# EAGLE design rc6551z80_v2 (EAGLE 9.6.2)
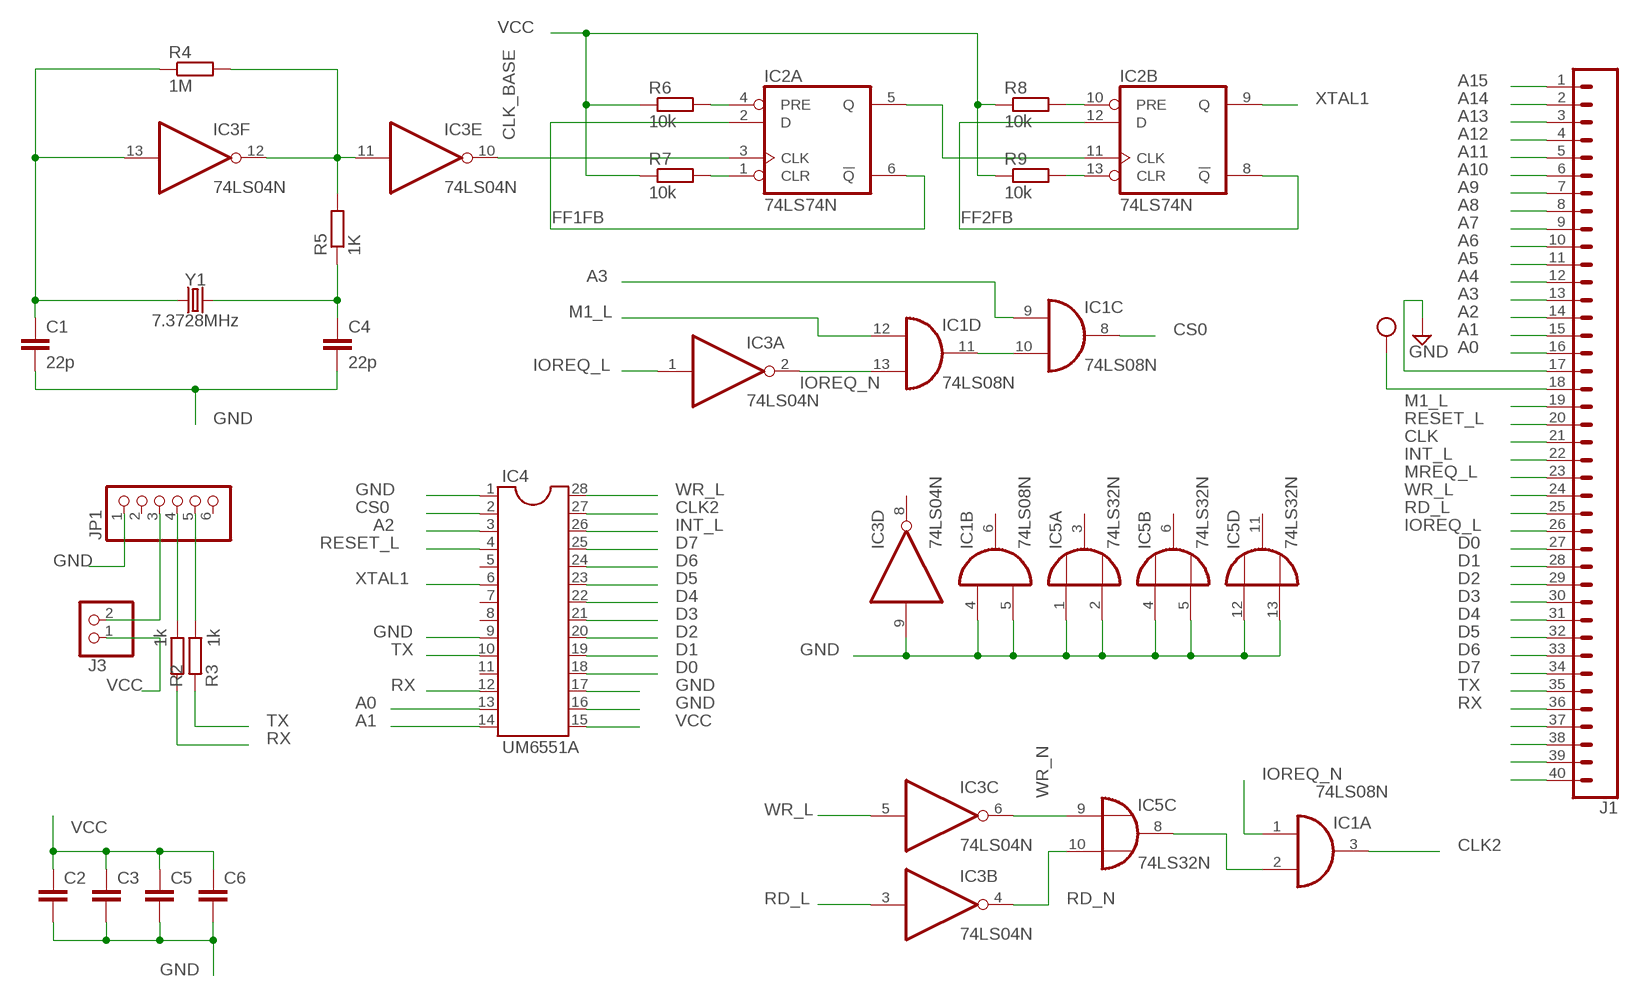
[diagram p0: schematic, sheet 1]

## Parts
C1  22p  C-EU025-024X044  [C025-024X044]
C2  C-EU050-025X075  [C050-025X075]
C3  C-EU050-025X075  [C050-025X075]
C4  22p  C-EU025-024X044  [C025-024X044]
C5  C-EU050-025X075  [C050-025X075]
C6  C-EU050-025X075  [C050-025X075]
IC1  74LS08N  [DIL14]
IC2  74LS74N  [DIL14]
IC3  74LS04N  [DIL14]
IC4  UM6551A  DIL28  [DIL28-6]
IC5  74LS32N  [DIL14]
J1  CONN_40OFFSET  [1X40_OFFSET]
J3  PINHD-1X2  [1X02]
JP1  PINHD-1X6  [1X06]
R2  1k  R-EU_0204/7  [0204/7]
R3  1k  R-EU_0204/7  [0204/7]
R4  1M  R-EU_0204/7  [0204/7]
R5  1K  R-EU_0204/7  [0204/7]
R6  10k  R-EU_0204/7  [0204/7]
R7  10k  R-EU_0204/7  [0204/7]
R8  10k  R-EU_0204/7  [0204/7]
R9  10k  R-EU_0204/7  [0204/7]
Y1  7.3728MHz  CRYSTALPTH-HC49UV  [HC49U]

## Nets
A0: IC4.13 J1.16
A1: IC4.14 J1.15
A2: IC4.3 J1.14
A3: IC1.9(C:I0) J1.13
A4: J1.12
A5: J1.11
A6: J1.10
A7: J1.9
A8: J1.8
A9: J1.7
A10: J1.6
A11: J1.5
A12: J1.4
A13: J1.3
A14: J1.2
A15: J1.1
CLK: J1.21
CLK2: IC1.3(A:O) IC4.27
CLK_BASE: IC2.3(A:CLK) IC3.10(E:O)
CS0: IC1.8(C:O) IC4.2
D0: IC4.18 J1.27
D1: IC4.19 J1.28
D2: IC4.20 J1.29
D3: IC4.21 J1.30
D4: IC4.22 J1.31
D5: IC4.23 J1.32
D6: IC4.24 J1.33
D7: IC4.25 J1.34
FF1FB: IC2.2(A:D) IC2.6(A:!Q)
FF2FB: IC2.8(B:!Q) IC2.12(B:D)
GND: C1.2 C2.2 C3.2 C4.2 C5.2 C6.2 IC1.4(B:I0) IC1.5(B:I1) IC3.9(D:I) IC4.1 IC4.9 IC4.16 IC4.17 IC5.1(A:I0) IC5.2(A:I1) IC5.4(B:I0) IC5.5(B:I1) IC5.12(D:I0) IC5.13(D:I1) J1.17 JP1.1
INT_L: IC4.26 J1.22
IOREQ_L: IC3.1(A:I) J1.26
IOREQ_N: IC1.1(A:I0) IC1.13(D:I1) IC3.2(A:O)
M1_L: IC1.12(D:I0) J1.19
MREQ_L: J1.23
N$1: J1.37
N$2: J1.38
N$3: J1.39
N$4: IC1.2(A:I1) IC5.8(C:O)
N$6: J3.2 JP1.3
N$7: JP1.4 R2.1
N$8: JP1.5 R3.1
N$9: C1.1 IC3.13(F:I) R4.1 Y1.1
N$10: C4.1 R5.1 Y1.2
N$11: IC3.11(E:I) IC3.12(F:O) R4.2 R5.2
N$13: J1.40
N$15: IC2.5(A:Q) IC2.11(B:CLK)
N$16: IC1.10(C:I1) IC1.11(D:O)
N$17: IC2.4(A:PRE) R6.2
N$18: IC2.1(A:CLR) R7.2
N$20: IC2.10(B:PRE) R8.2
N$21: IC2.13(B:CLR) R9.2
RD_L: IC3.3(B:I) J1.25
RD_N: IC3.4(B:O) IC5.10(C:I1)
RESET_L: IC4.4 J1.20
RX: IC4.12 J1.36 R2.2
TX: IC4.10 J1.35 R3.2
VCC: C2.1 C3.1 C5.1 C6.1 IC4.15 J1.18 J3.1 R6.1 R7.1 R8.1 R9.1
WR_L: IC3.5(C:I) IC4.28 J1.24
WR_N: IC3.6(C:O) IC5.9(C:I0)
XTAL1: IC2.9(B:Q) IC4.6
Unconnected: IC1.6(B:O) IC3.8(D:O) IC4.5 IC4.7 IC4.8 IC4.11 IC5.3(A:O) IC5.6(B:O) IC5.11(D:O) JP1.2 JP1.6

## Power pins joined to a net without a drawn wire
GND: IC1.7(P:GND) IC2.7(P:GND) IC3.7(P:GND) IC5.7(P:GND)
VCC: IC1.14(P:VCC) IC2.14(P:VCC) IC3.14(P:VCC) IC5.14(P:VCC)

## Library data of the parts
C1 C4 = rcl:C-EU: CAPACITOR, European symbol; SPICEPREFIX: C
C2 C3 C5 C6 = LabE:C-EU: CAPACITOR, European symbol; SPICEPREFIX: C
IC1 = 74xx-eu:74*08: Quad 2-input AND gate
IC2 = 74xx-eu:74*74: Dual D type positive edge triggered FLIP FLOP, preset and clear
IC3 = 74xx-eu:74*04: Hex INVERTER
IC4 = ic-package:DIL28: Dual In Line
IC5 = 74xx-eu:74*32: Quad 2-input OR gate
J1 = SparkFun-Connectors:CONN_40: Multi connection point. Often used as Generic Header-pin footprint for 0.1 inch spaced/style header connections On any of the 0.1 inch spaced packages, you can populate with these: Break Away Headers - Straight <https://www.sparkfun.com/products/116> (PRT-00116) Break Away Male Headers - Right Angle <https://www.sparkfun.com/products/553> (PRT-00553) Female Headers <https://www.sparkfun.com/products/115> (PRT-00115) Break Away Headers - Machine Pin <https://www.sparkfun.com/products/117> (PRT-00117) Break Away Female Headers - Swiss Machine Pin <https://www.sparkfun.com/products/743> (PRT-00743) For SCREWTERMINALS and SPRING TERMINALS visit here: Screw Terimnals on SparkFun.com <https://www.sparkfun.com/search/results?term=Screw+Terminals> (5mm/3.5mm/2.54mm spacing) This device is also useful as a general connection point to wire up your design to another part of your project. Our various solder wires solder well into these plated through hole pads. Hook-Up Wire - Assortment (Stranded, 22 AWG) <https://www.sparkfun.com/products/11375> (PRT-11375) Hook-Up Wire - Assortment (Solid Core, 22 AWG) <https://www.sparkfun.com/products/11367> (PRT-11367) View the entire wire category on our website here <https://www.sparkfun.com/categories/141> Special notes: Molex polarized connector foot print use with SKU : PRT-08231 with associated crimp pins and housings. 1MM SMD Version SKU: PRT-10208 NOTES ON THE VARIANTS LOCK and LOCK_LONGPADS... This footprint was designed to help hold the alignment of a through-hole component (i.e. 6-pin header) while soldering it into place. You may notice that each hole has been shifted either up or down by 0.005 of an inch from it's more standard position (which is a perfectly straight line). This slight alteration caused the pins (the squares in the middle) to touch the edges of the holes. Because they are alternating, it causes a "brace" to hold the component in place. 0.005 has proven to be the perfect amount of "off-center" position when using our standard breakaway headers. Although looks a little odd when you look at the bare footprint, once you have a header in there, the alteration is very hard to notice. Also,if you push a header all the way into place, it is covered up entirely on the bottom side.
J3 = pinhead:PINHD-1X2: PIN HEADER
JP1 = pinhead:PINHD-1X6: PIN HEADER
R2-R9 = rcl:R-EU_: RESISTOR, European symbol; SPICEPREFIX: R
Y1 = SparkFun-Clocks:CRYSTAL: Crystals (Generic) These are passive quartz crystals, which can be used as a clock source for a microcontroller. Crystal's are two-terminal devices. They require external "load" capacitors to generate an oscillating signal.

## Board
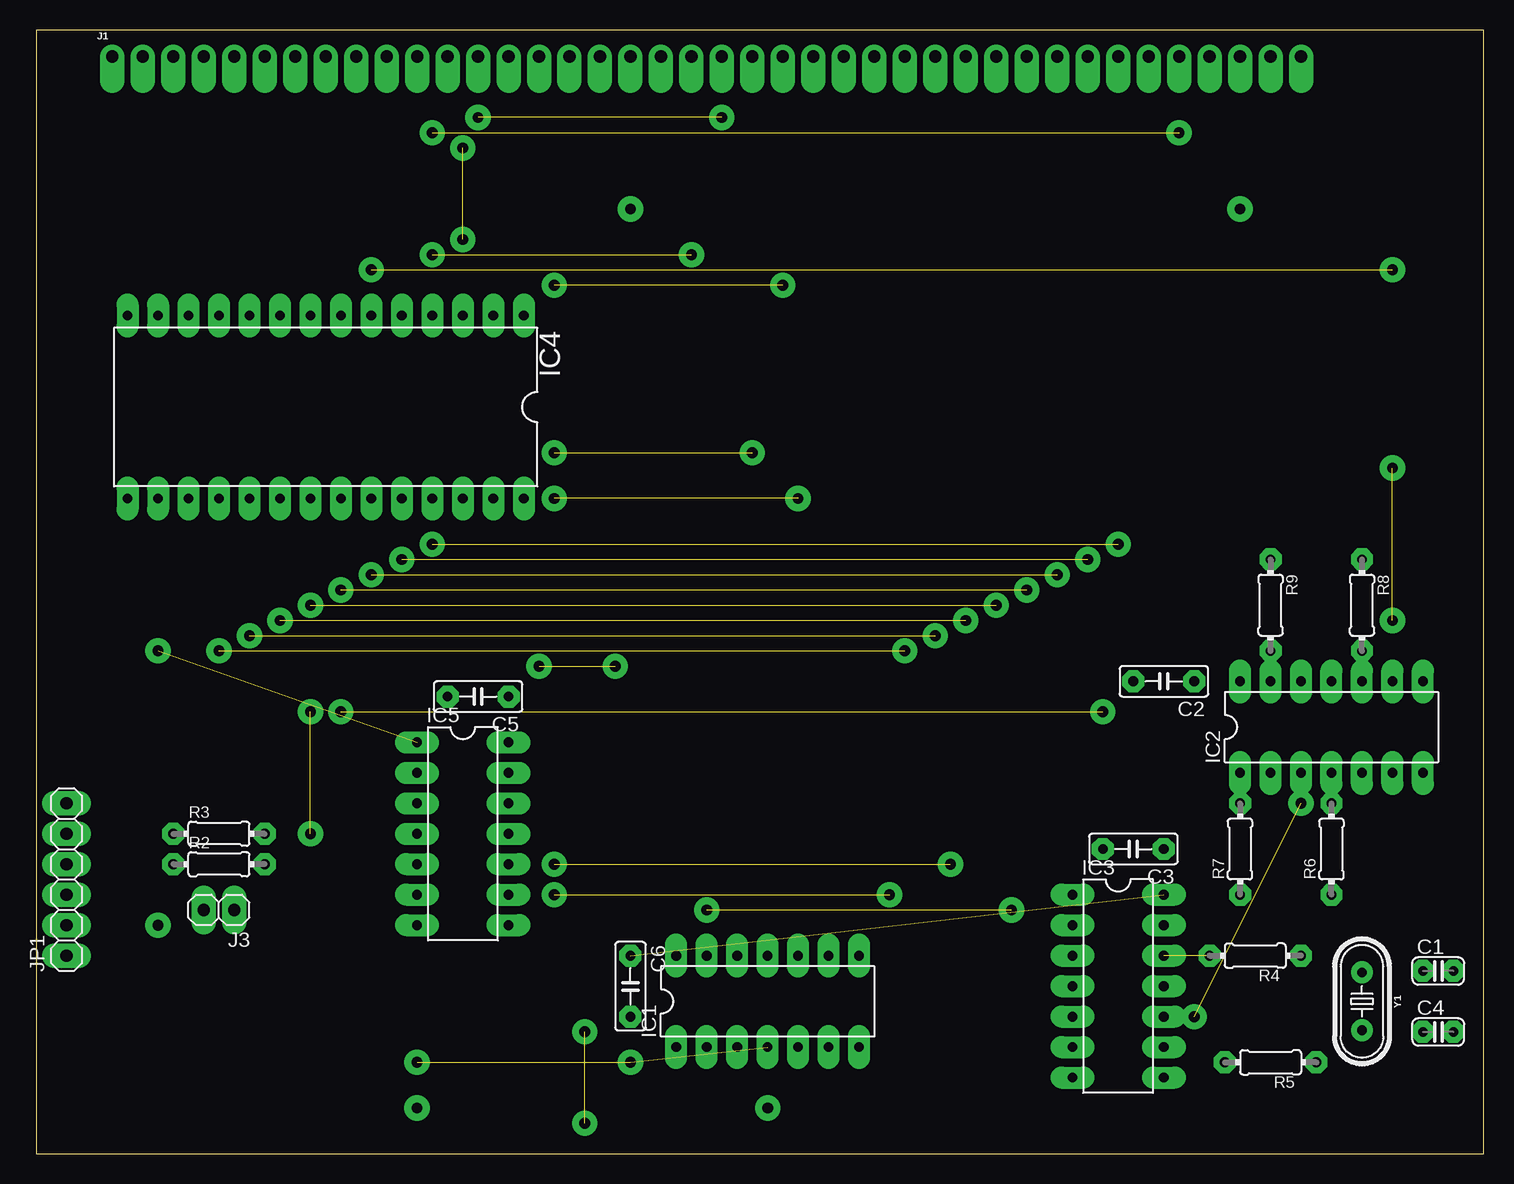
[diagram p1: board, top side]
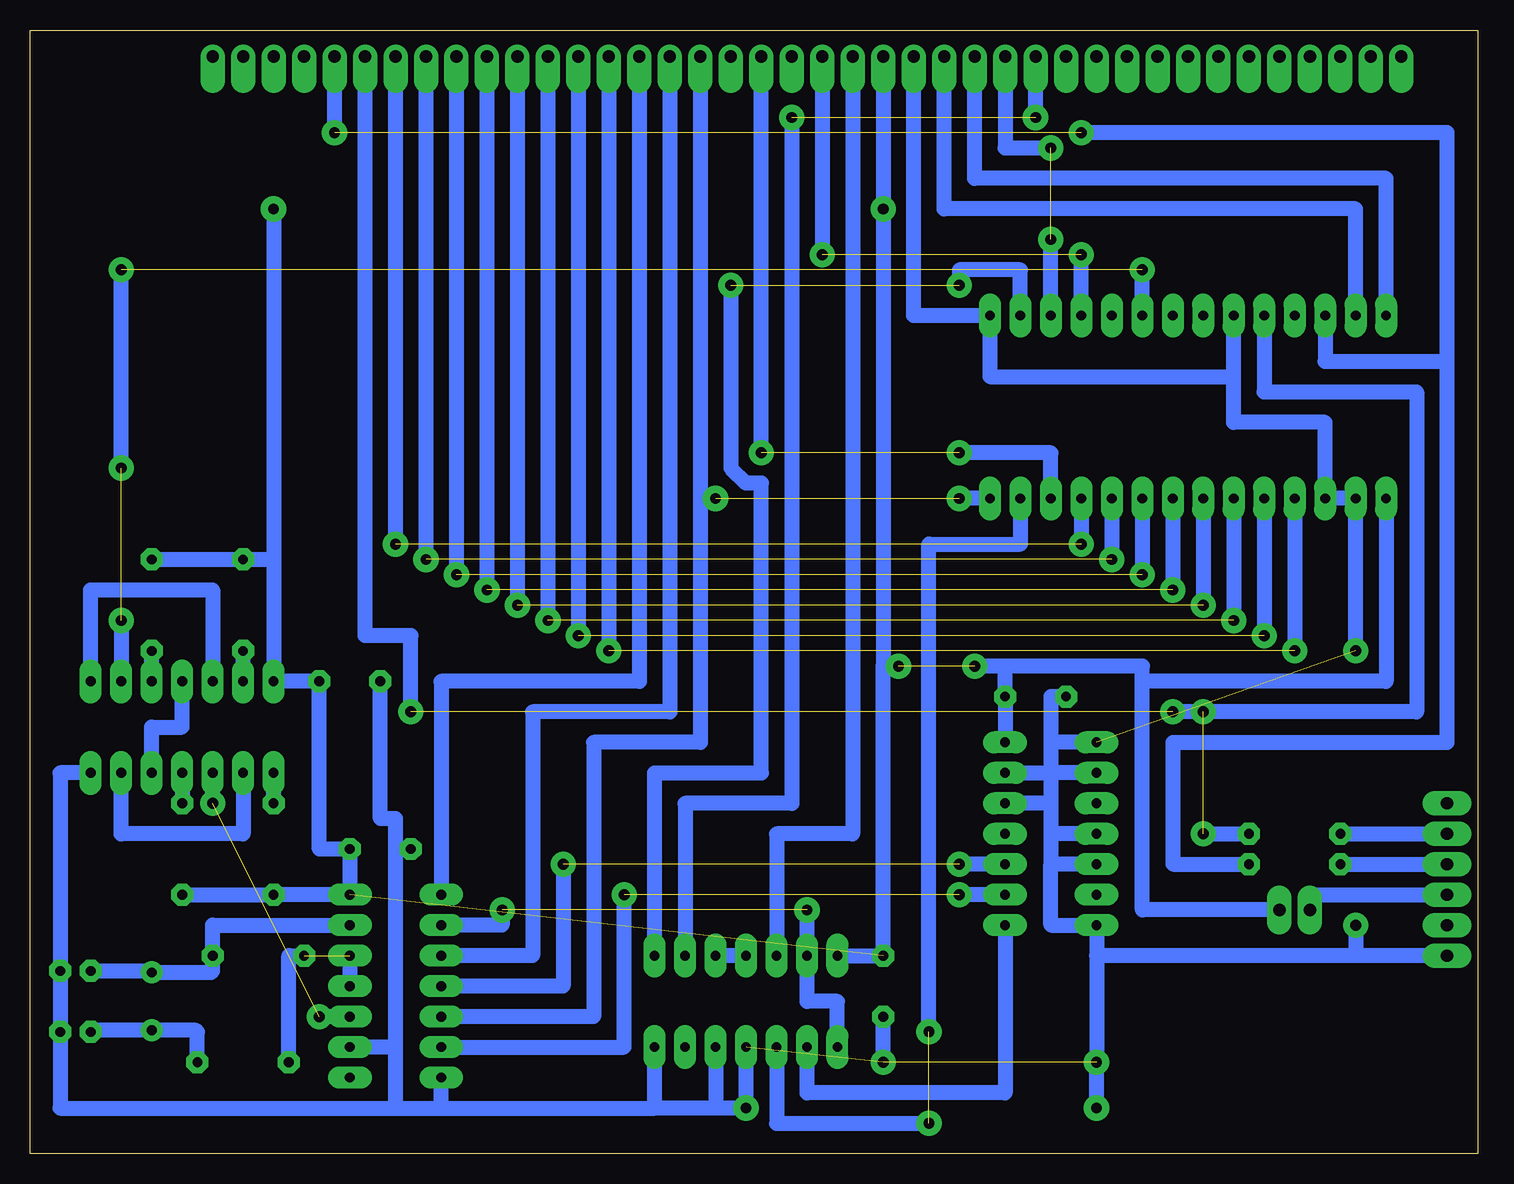
[diagram p2: board, bottom side, seen from below]

Size 120.63 x 93.65 mm. Coordinates in mm from the lower left corner, seen from the top.
Outline: 0,0 120.63,0 120.63,93.65 0,93.65 0,0
Copper layers (1*16): Top 0.035mm / dielectric 1.5mm / Bottom 0.035mm
Design rules "LabE": minimum track width 50mil, minimum drill 0.8mm, track to track 16mil, track to pad 16mil, pad to pad 16mil, via to via 16mil, smd to smd 16mil, copper to edge 0mil, drill to drill 16mil, minimum pad ring 20mil, minimum via ring 20mil, stop-mask expansion 4mil, vias tented up to drill 0mil, thermal gap 10mil

### Footprints (pad centres in the part's own frame; a part is rotated, then mirrored left to right if it is on the bottom)
C025-024X044 = drill 0.813 octagon: 1 -1.27,0; 2 1.27,0
C050-025X075 = drill 0.813 octagon: 1 -2.54,0; 2 2.54,0
DIL14 = drill 0.813 long: 1 -7.62,-3.81; 2 -5.08,-3.81; 3 -2.54,-3.81; 4 0,-3.81; 5 2.54,-3.81; 6 5.08,-3.81; 7 7.62,-3.81; 8 7.62,3.81; 9 5.08,3.81; 10 2.54,3.81; 11 0,3.81; 12 -2.54,3.81; 13 -5.08,3.81; 14 -7.62,3.81
DIL28-6 = drill 0.813 long: 1 -16.51,-7.62; 2 -13.97,-7.62; 3 -11.43,-7.62; 4 -8.89,-7.62; 5 -6.35,-7.62; 6 -3.81,-7.62; 7 -1.27,-7.62; 8 1.27,-7.62; 9 3.81,-7.62; 10 6.35,-7.62; 11 8.89,-7.62; 12 11.43,-7.62; 13 13.97,-7.62; 14 16.51,-7.62; 15 16.51,7.62; 16 13.97,7.62; 17 11.43,7.62; 18 8.89,7.62; 19 6.35,7.62; 20 3.81,7.62; 21 1.27,7.62; 22 -1.27,7.62; 23 -3.81,7.62; 24 -6.35,7.62; 25 -8.89,7.62; 26 -11.43,7.62; 27 -13.97,7.62; 28 -16.51,7.62
1X40_OFFSET = drill 1.016 pad 1.88 offset: 1 0,0; 2 2.54,0; 3 5.08,0; 4 7.62,0; 5 10.16,0; 6 12.7,0; 7 15.24,0; 8 17.78,0; 9 20.32,0; 10 22.86,0; 11 25.4,0; 12 27.94,0; 13 30.48,0; 14 33.02,0; 15 35.56,0; 16 38.1,0; 17 40.64,0; 18 43.18,0; 19 45.72,0; 20 48.26,0; 21 50.8,0; 22 53.34,0; 23 55.88,0; 24 58.42,0; 25 60.96,0; 26 63.5,0; 27 66.04,0; 28 68.58,0; 29 71.12,0; 30 73.66,0; 31 76.2,0; 32 78.74,0; 33 81.28,0; 34 83.82,0; 35 86.36,0; 36 88.9,0; 37 91.44,0; 38 93.98,0; 39 96.52,0; 40 99.06,0
1X02 = drill 1.016 long: 1 -1.27,0; 2 1.27,0
1X06 = drill 1.016 long: 1 -6.35,0; 2 -3.81,0; 3 -1.27,0; 4 1.27,0; 5 3.81,0; 6 6.35,0
0204/7 = drill 0.813 octagon: 1 -3.81,0; 2 3.81,0
HC49U = drill 0.813: 1 -2.413,0; 2 2.413,0

### Placement (x,y rotation side)
C1  116.84,15.24 0 top
C2  93.98,39.37 180 top
C3  91.44,25.4 180 top
C4  116.84,10.16 0 top
C5  36.83,38.1 180 top
C6  49.53,13.97 270 top
IC1  60.96,12.7 0 top
IC2  107.95,35.56 0 top
IC3  90.17,13.97 270 top
IC4  24.13,62.23 180 top
IC5  35.56,26.67 270 top
J1  6.35,91.44 0 top
J3  15.24,20.32 180 top
JP1  2.54,22.86 90 top
R2  15.24,24.13 0 top
R3  15.24,26.67 0 top
R4  101.6,16.51 180 top
R5  102.87,7.62 180 top
R6  107.95,25.4 90 top
R7  100.33,25.4 90 top
R8  110.49,45.72 270 top
R9  102.87,45.72 270 top
Y1  110.49,12.7 270 top

### Tracks (layer width: path | path; a pad name or v marks a point on that pad's centre or on a via)
A0
  Bottom 1.27: IC4.13 10.16,78.74 44.45,78.74 J1.16
A1
  Bottom 1.27: IC4.14 7.62,81.28 41.91,81.28 J1.15
A2  (via drill 0.9 pad 2.1)  (1 unrouted)
  Bottom 1.27: IC4.3 v35.56,76.2 | J1.14 39.37,83.82 v35.56,83.82
A3  (via drill 0.9 pad 2.1)  (1 unrouted)
  Bottom 1.27: IC1.9 66.04,29.21 57.15,29.21 v57.15,86.36 | v36.83,86.36 J1.13
CLK2  (via drill 0.9 pad 2.1)  (1 unrouted)
  Bottom 1.27: IC4.27 38.1,50.8 45.72,50.8 v45.72,10.16 | IC1.3 58.42,2.54 v45.72,2.54
CLK_BASE  (via drill 0.9 pad 2.1)  (1 unrouted)
  Bottom 1.27: v105.41,29.21 IC2.3 | IC3.10 v96.52,11.43
CS0  (via drill 0.9 pad 2.1)  (1 unrouted)
  Bottom 1.27: IC1.8 68.58,31.75 59.69,31.75 59.69,55.88 60.96,55.88 62.23,57.15 v62.23,72.39 | IC4.2 38.1,73.66 43.18,73.66 v43.18,72.39
D0  (via drill 0.9 pad 2.1)  (1 unrouted)
  Bottom 1.27: IC4.18 v15.24,41.91 | J1.27 v72.39,41.91
D1  (via drill 0.9 pad 2.1)  (1 unrouted)
  Bottom 1.27: IC4.19 v17.78,43.18 | J1.28 v74.93,43.18
D2  (via drill 0.9 pad 2.1)  (1 unrouted)
  Bottom 1.27: IC4.20 v20.32,44.45 | J1.29 v77.47,44.45
D3  (via drill 0.9 pad 2.1)  (1 unrouted)
  Bottom 1.27: IC4.21 v22.86,45.72 | J1.30 v80.01,45.72
D4  (via drill 0.9 pad 2.1)  (1 unrouted)
  Bottom 1.27: IC4.22 v25.4,46.99 | J1.31 v82.55,46.99
D5  (via drill 0.9 pad 2.1)  (1 unrouted)
  Bottom 1.27: IC4.23 v27.94,48.26 | J1.32 v85.09,48.26
D6  (via drill 0.9 pad 2.1)  (1 unrouted)
  Bottom 1.27: IC4.24 v30.48,49.53 | v87.63,49.53 J1.33
D7  (via drill 0.9 pad 2.1)  (1 unrouted)
  Bottom 1.27: IC4.25 v33.02,50.8 | v90.17,50.8 J1.34
FF1FB
  Bottom 1.27: IC2.2 102.87,26.67 113.03,26.67 IC2.6
FF2FB
  Bottom 1.27: IC2.8 115.57,46.99 105.41,46.99 IC2.12
GND  (via drill 0.9 pad 2.1)  (3 unrouted)
  Bottom 1.27: IC2.7 118.11,31.75 C1.2 C4.2 118.11,3.81 90.17,3.81 | 90.17,3.81 86.36,3.81 | 86.36,3.81 IC3.7 | 90.17,3.81 90.17,8.89 | 90.17,8.89 IC3.9 | J1.17 46.99,69.85 IC4.1 40.64,64.77 20.32,64.77 | 20.32,64.77 20.32,60.96 12.7,60.96 IC4.17 IC4.16 v10.16,41.91 | 20.32,64.77 IC4.9 | C5.2 35.56,38.1 35.56,34.29 | 35.56,34.29 35.56,31.75 | 35.56,31.75 35.56,29.21 | 35.56,29.21 35.56,26.67 | 35.56,26.67 35.56,24.13 | 35.56,24.13 35.56,19.05 IC5.7 31.75,16.51 | IC5.5 35.56,24.13 | IC5.4 35.56,26.67 | IC5.2 35.56,31.75 | IC5.1 35.56,34.29 | IC1.5 63.5,3.81 | 63.5,3.81 68.58,3.81 | 68.58,3.81 IC1.7 | 90.17,8.89 90.17,25.4 | C3.2 90.17,25.4 | 31.75,16.51 v31.75,7.62 v31.75,3.81 | v49.53,7.62 C6.2 | IC1.4 v60.96,3.81 63.5,3.81 | 86.36,3.81 68.58,3.81 | 90.17,25.4 90.17,27.94 91.44,27.94 C2.2 | IC5.13 35.56,31.75 | 35.56,29.21 IC5.12 | JP1.1 10.16,16.51 | 10.16,16.51 31.75,16.51 | v10.16,19.05 10.16,16.51
INT_L  (via drill 0.9 pad 2.1)  (1 unrouted)
  Bottom 1.27: IC4.26 35.56,58.42 v43.18,58.42 | v59.69,58.42 J1.22
IOREQ_L
  Bottom 1.27: J1.26 69.85,39.37 86.36,39.37 IC3.1
IOREQ_N  (via drill 0.9 pad 2.1)  (1 unrouted)
  Bottom 1.27: IC1.1 53.34,12.7 55.88,12.7 IC1.13 v55.88,20.32 | v81.28,20.32 81.28,19.05 IC3.2
M1_L
  Bottom 1.27: J1.19 52.07,26.67 58.42,26.67 IC1.12
N$4
  Bottom 1.27: IC5.8 39.37,5.08 55.88,5.08 IC1.2
N$6
  Bottom 1.27: J3.2 13.97,21.59 JP1.3
N$7
  Bottom 1.27: R2.1 JP1.4
N$8
  Bottom 1.27: R3.1 JP1.5
N$9
  Bottom 1.27: C1.1 110.62,15.24 Y1.1 105.54,15.11 105.41,15.24 R4.1 105.41,19.05 IC3.13
N$10
  Bottom 1.27: C4.1 115.44,10.29 Y1.2 106.81,10.29 106.68,10.16 R5.1
N$11  (1 unrouted)
  Bottom 1.27: IC3.12 IC3.11 | R5.2 99.06,16.51 R4.2
N$15
  Bottom 1.27: IC2.5 110.49,35.56 107.95,35.56 IC2.11
N$16
  Bottom 1.27: IC1.11 IC1.10
N$17
  Bottom 1.27: IC2.4 R6.2
N$18
  Bottom 1.27: R7.2 IC2.1
N$20
  Bottom 1.27: IC2.10 R8.2
N$21
  Bottom 1.27: IC2.13 R9.2
RD_L
  Bottom 1.27: J1.25 67.31,36.83 78.74,36.83 78.74,16.51 IC3.3
RD_N  (via drill 0.9 pad 2.1)  (1 unrouted)
  Bottom 1.27: v76.2,24.13 76.2,13.97 IC3.4 | IC5.10 v43.18,24.13
RESET_L  (via drill 0.9 pad 2.1)  (1 unrouted)
  Bottom 1.27: J1.20 v54.61,74.93 | IC4.4 v33.02,74.93
RX  (via drill 0.9 pad 2.1)  (1 unrouted)
  Bottom 1.27: IC4.12 12.7,66.04 2.54,66.04 | 2.54,66.04 2.54,34.29 25.4,34.29 25.4,24.13 R2.2 | 2.54,66.04 2.54,85.09 v33.02,85.09 | v95.25,85.09 J1.36
TX  (via drill 0.9 pad 2.1)  (2 unrouted)
  Bottom 1.27: IC4.10 17.78,63.5 5.08,63.5 5.08,36.83 v22.86,36.83 v25.4,36.83 | v22.86,26.67 R3.2 | v88.9,36.83 88.9,43.18 92.71,43.18 J1.35
VCC  (via drill 0.9 pad 2.1)  (2 unrouted)
  Bottom 1.27: R6.1 R7.1 IC3.14 C3.1 96.52,25.4 C2.1 IC2.14 100.33,49.53 | IC5.14 C5.1 39.37,40.64 | R8.1 R9.1 100.33,49.53 | IC4.15 7.62,39.37 27.94,39.37 | J3.1 27.94,20.32 27.94,39.37 | J1.18 v49.53,78.74 49.53,40.64 | 27.94,39.37 27.94,40.64 39.37,40.64 | 39.37,40.64 v41.91,40.64 | v100.33,78.74 100.33,49.53 | v48.26,40.64 49.53,40.64 | IC1.14 C6.1 49.53,40.64
WR_L  (via drill 0.9 pad 2.1)  (1 unrouted)
  Bottom 1.27: J1.24 64.77,54.61 | 64.77,54.61 64.77,34.29 73.66,34.29 73.66,11.43 IC3.5 | v63.5,54.61 64.77,54.61 | IC4.28 v43.18,54.61
WR_N  (via drill 0.9 pad 2.1)  (1 unrouted)
  Bottom 1.27: IC3.6 71.12,8.89 v71.12,21.59 | IC5.9 v43.18,21.59
XTAL1  (via drill 0.9 pad 2.1)  (2 unrouted)
  Bottom 1.27: IC4.6 v27.94,73.66 | v113.03,57.15 v113.03,73.66 | v113.03,44.45 IC2.9